# Altium project workerBoard.PrjPcb
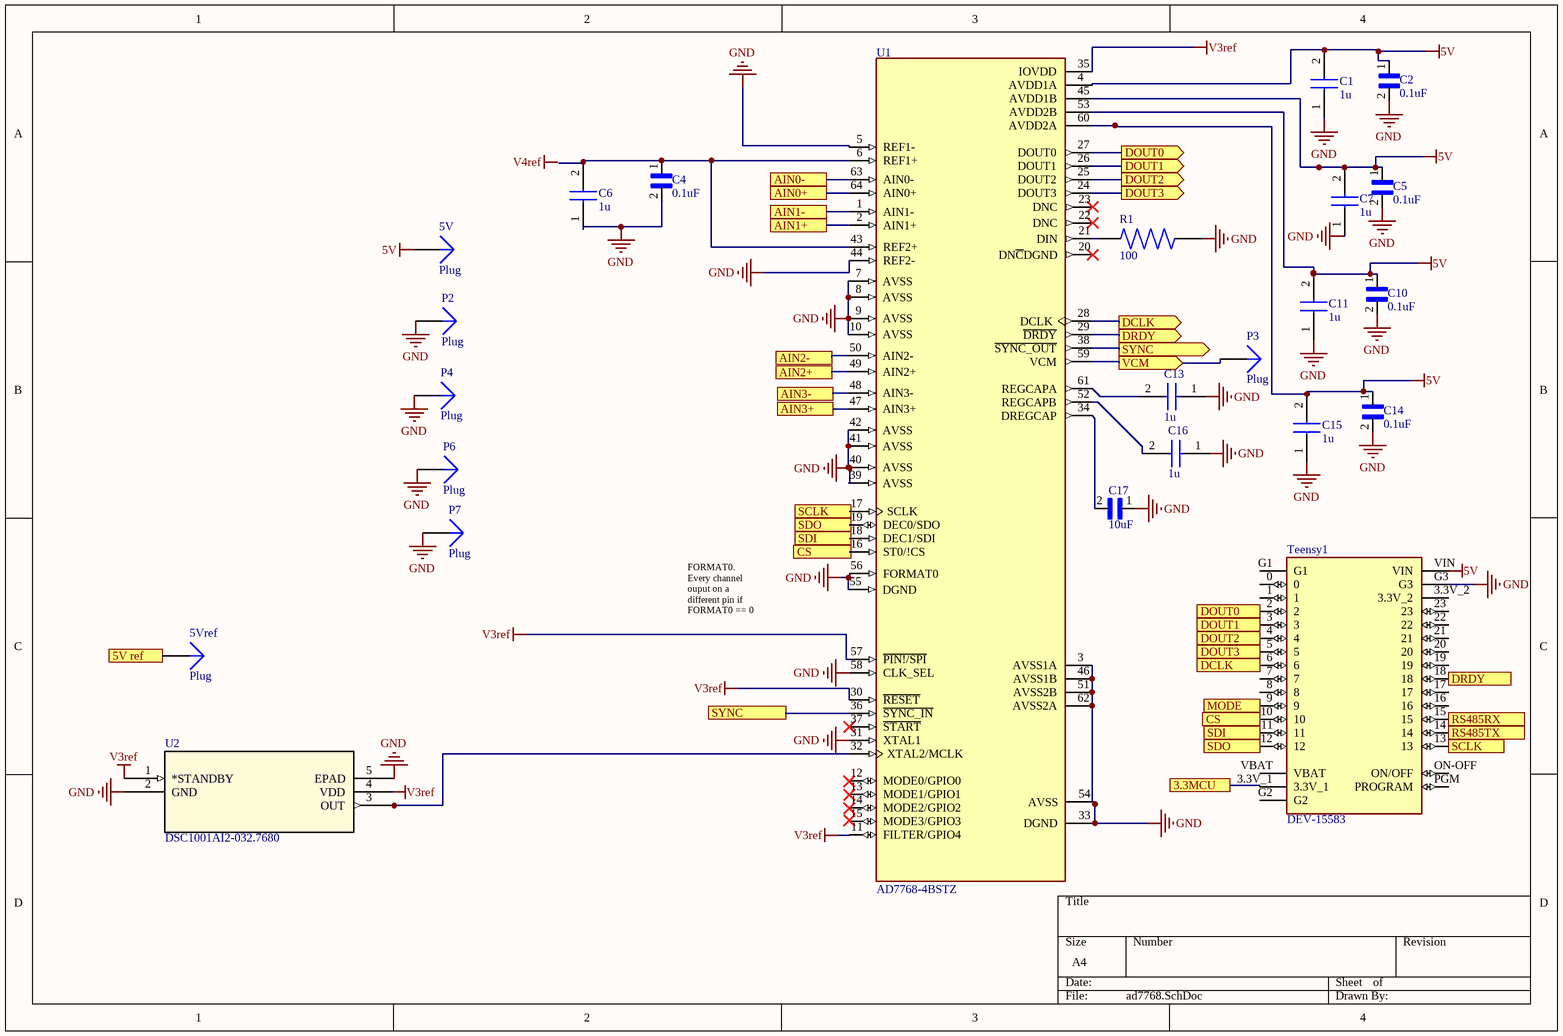
[diagram p0: ad7768.SchDoc]
6 sheets, 91 parts. Net scope: flat (ports and power ports of the same name join across sheets).
Board files: ADC_RS_MCU_draft.PcbDoc, accel.PcbDoc, ADC_RS_MCU.PcbDoc
Sheets:
  ad7768.SchDoc
  Vref.SchDoc
  driver0-3.SchDoc
  thvd8000.SchDoc
  accel.SchDoc
  power_supply.SchDoc

## Sheet ad7768.SchDoc
size A4; SheetNumber: 1; SheetTotal: 6

### Parts
5V  Plug  [PIN1]
5Vref  Plug  [PIN1]
C1  1u  [CAPC1608X90N]
C2  0.1uF  [CAPC1608X90N]
C4  0.1uF  [CAPC1608X90N]
C5  0.1uF  [CAPC1608X90N]
C6  1u  [CAPC1608X90N]
C7  1u  [CAPC1608X90N]
C10  0.1uF  [CAPC1608X90N]
C11  1u  [CAPC1608X90N]
C13  1u  [CAPC1608X90N]
C14  0.1uF  [CAPC1608X90N]
C15  1u  [CAPC1608X90N]
C16  1u  [CAPC1608X90N]
C17  10uF  [CAPC1608X9N]
P2  Plug  [PIN1]
P3  Plug  [PIN1]
P4  Plug  [PIN1]
P6  Plug  [PIN1]
P7  Plug  [PIN1]
R1  100  [RESC1508X55N]
Teensy1  DEV-15583  [MODULE_DEV-15583]
U1  AD7768-4BSTZ
U2  DSC1001AI2-032.7680  [DFN4_7X5_MCH]

### Ports
3.3MCU, 5V ref, AIN0+, AIN0-, AIN1+, AIN1-, AIN2+, AIN2-, AIN3+, AIN3-, CS, DCLK (out), DOUT0 (out), DOUT1 (out), DOUT2 (out), DOUT3 (out), DRDY (out), MODE, RS485RX, RS485TX, SCLK, SDI, SDO, SYNC, SYNC (out), VCM (out)

### Nets
5V: 5V.1 C1.2 C2.1 C5.1 C7.2 C10.1 C11.2 C14.1 C15.2 Teensy1.VIN U1.4(AVDD1A) U1.45(AVDD1B) U1.53(AVDD2B) U1.60(AVDD2A)
GND: C1.1 C2.2 C4.2 C5.2 C6.1 C7.1 C10.2 C11.1 C13.1 C14.2 C15.1 C16.1 C17.1 P2.1 P4.1 P6.1 P7.1 R1.2 Teensy1.G3 U1.3(AVSS1A) U1.5(REF1-) U1.7(AVSS) U1.8(AVSS) U1.9(AVSS) U1.10(AVSS) U1.31(XTAL1) U1.33(DGND) U1.39(AVSS) U1.40(AVSS) U1.41(AVSS) U1.42(AVSS) U1.44(REF2-) U1.46(AVSS1B) U1.51(AVSS2B) U1.54(AVSS) U1.55(DGND) U1.56(FORMAT0) U1.58(CLK_SEL) U1.62(AVSS2A) U2.2(GND) U2.5(EPAD)
V3ref: U1.11(FILTER/GPIO4) U1.30(~{RESET}) U1.35(IOVDD) U1.57(~{PIN!/SPI}) U2.1(*STANDBY) U2.4(VDD)
3.3MCU: Teensy1.3.3V_1 ; port 3.3MCU
5V ref: 5Vref.1 ; port 5V ref
AIN0+: U1.64(AIN0+) ; port AIN0+
AIN0-: U1.63(AIN0-) ; port AIN0-
AIN1+: U1.2(AIN1+) ; port AIN1+
AIN1-: U1.1(AIN1-) ; port AIN1-
AIN2+: U1.49(AIN2+) ; port AIN2+
AIN2-: U1.50(AIN2-) ; port AIN2-
AIN3+: U1.47(AIN3+) ; port AIN3+
AIN3-: U1.48(AIN3-) ; port AIN3-
CS: Teensy1.10 U1.16(ST0/!CS) ; port CS
DCLK: Teensy1.6 U1.28(DCLK) ; port DCLK
DOUT0: Teensy1.2 U1.27(DOUT0) ; port DOUT0
DOUT1: Teensy1.3 U1.26(DOUT1) ; port DOUT1
DOUT2: Teensy1.4 U1.25(DOUT2) ; port DOUT2
DOUT3: Teensy1.5 U1.24(DOUT3) ; port DOUT3
DRDY: Teensy1.18 U1.29(~{DRDY}) ; port DRDY
MODE: Teensy1.9 ; port MODE
RS485RX: Teensy1.15 ; port RS485RX
RS485TX: Teensy1.14 ; port RS485TX
SCLK: Teensy1.13 U1.17(SCLK) ; port SCLK
SDI: Teensy1.11 U1.18(DEC1/SDI) ; port SDI
SDO: Teensy1.12 U1.19(DEC0/SDO) ; port SDO
SYNC: U1.36(~{SYNC_IN}) U1.38(~{SYNC_OUT}) ; port SYNC
VCM: P3.1 U1.59(VCM) ; port VCM
NetC4_1: C4.1 C6.2 U1.6(REF1+) U1.43(REF2+)
NetC13_2: C13.2 U1.61(REGCAPA)
NetC16_2: C16.2 U1.52(REGCAPB)
NetC17_2: C17.2 U1.34(DREGCAP)
NetR1_1: R1.1 U1.21(DIN)
NetU1_32: U1.32(XTAL2/MCLK) U2.3(OUT)

Not connected (* = marked no-connect by the designer): Teensy1 0 1 3.3V_2 7 8 16 17 19 20 21 22 23 G1 G2 ON-OFF(ON/OFF) PGM(PROGRAM) VBAT; U1 12(MODE0/GPIO0)* 13(MODE1/GPIO1)* 14(MODE2/GPIO2)* 15(MODE3/GPIO3) 20(DN~{C}DGND)* 22(DNC)* 23(DNC)* 37(~{START})*

### Notes on the sheet
- FORMAT0. Every channel ouput on a different pin if FORMAT0 == 0
- Labels drawn without touching a wire or pin: V4ref

### Library data of the parts
5V 5Vref P2-P4 P6 P7 = CMP-010-000007-1: Signal Integrity: Connector; LatestRevisionDate: 17-Jul-2002; LatestRevisionNote: Re-released for DXP Platform.; Publisher: Altium Limited; Component Type: Standard; Design Item ID: Plug; Pin Count: 1; Source: workerBoard.SCHLIB
C1 C6 C7 C11 C13 C15 C16 = CMP-003-000003-1: Capacitor; Manufacturer_Name: AVX; Datasheet Link: https://componentsearchengine.com/Datasheets/1/06031A100FAT2A.pdf; Height: 0.9mm; Manufacturer_Part_Number: 0603YC105MAT4A; Component Type: Standard; Design Item ID: 0603YC105MAT4A; Pin Count: 2; Source: workerBoard.SCHLIB
C2 C4 C5 C10 C14 = CMP-003-000001-1: Cap Ceramic 0.1uF 25V X5R 10% SMD 0603 85ÂÂŽ T/R; MF: {'manufacturer': u'AVX'}; Price: None; Availability: Unavailable; Value: *; MP: 06033D104KAT2A; Package: None; Component Type: Standard; Design Item ID: 06033D104KAT2A; Pin Count: 2; Source: workerBoard.SCHLIB
C17 = CMP-003-000008-1: CAP CER 10UF 10V X5R 0603; MP: GRT188R61A106ME13D; MF: {'manufacturer': u'Murata'}; Price: None; Availability: Unavailable; Value: *; Package: None; Component Type: Standard; Design Item ID: GRT188R61A106ME13D; Pin Count: 2; Source: workerBoard.SCHLIB
R1 = CMP-008-000002-1: MP: MCT0603MD1000DP500; MF: {'manufacturer': u'Vishay'}; Price: None; Availability: Unavailable; Value: *; Package: None; Component Type: Standard; Design Item ID: MCT0603MD1000DP500; Pin Count: 2; Source: workerBoard.SCHLIB
Teensy1 = CMP-010-000005-1: RT1062 Teensy 4.0 i.MX ARMÂ® CortexÂ®-M7 MPU Embedded Evaluation Board; MF: SparkFun Electronics; Value: *; Package: None; Digi-Key_Part_Number: 1568-DEV-15583-ND; Digi-Key_Purchase_URL: https://www.digikey.com/product-detail/en/sparkfun-electronics/DEV-15583/1568-DEV-15583-ND/10384551?utm_source=snapeda&utm_medium=aggregator&utm_campaign=symbol; MP: DEV-15583; SnapEDA_Link: https://www.snapeda.com/parts/DEV-15583/SparkFun%20Electronics/view-part/4001229/?ref=snap; Component Type: Standard; Design Item ID: DEV-15583; Pin Count: 33; Source: workerBoard.SCHLIB
U1 = CMP-005-000000-1: 24 Bit Analog to Digital Converter 4 Input 4 Sigma-Delta 64-LQFP _10x10_; MF: Analog Devices; Digi-Key_Purchase_URL: https://www.digikey.com/product-detail/en/analog-devices-inc/AD7768-4BSTZ/AD7768-4BSTZ-ND/6072260?utm_source=snapeda&utm_medium=aggregator&utm_campaign=symbol; Package: LQFP -64 Analog Devices; SnapEDA_Link: https://www.snapeda.com/parts/AD7768-4BSTZ/Analog%20Devices%20Inc./view-part/501603/?ref=snap; Value: *; MP: AD7768-4BSTZ; Digi-Key_Part_Number: AD7768-4BSTZ-ND; Component Type: Standard; Design Item ID: AD7768-4BSTZ; Pin Count: 64; Source: workerBoard.SCHLIB
U2 = CMP-010-000006-1: No Description Available; Mfr_Name: Microchip; Copyright: Copyright (C) 2021 Ultra Librarian. All rights reserved.; Manufacturer_Part_Number: DSC1001AI2-032.7680; Digi-Key_Part_Number_1: DSC1001AI2-032.7680-ND; RefDes: RefDes; Type: DEV; Component Type: Standard; Design Item ID: DSC1001AI2-032.7680; Pin Count: 5; Source: workerBoard.SCHLIB

## Sheet Vref.SchDoc
size A4; SheetNumber: 2; SheetTotal: 6
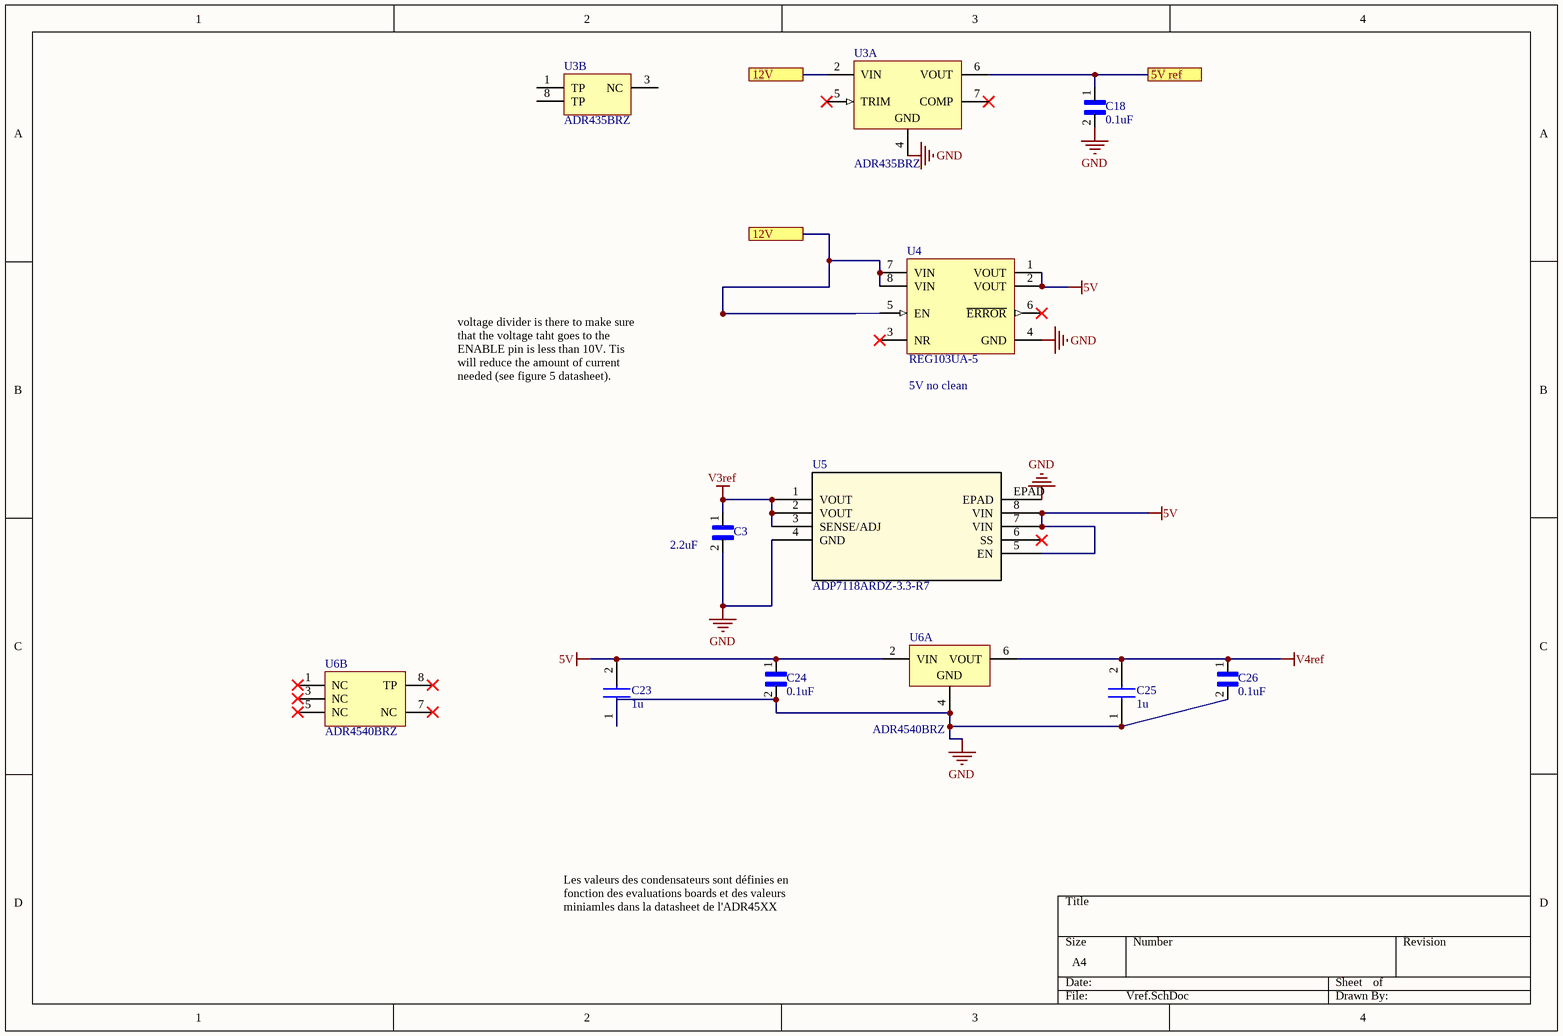
[diagram p1: Vref.SchDoc]

### Parts
C3  2.2uF  [CAPC1608X90]
C18  0.1uF  [CAPC1608X90N]
C23  1u  [CAPC1608X90N]
C24  0.1uF  [CAPC1608X90N]
C25  1u  [CAPC1608X90N]
C26  0.1uF  [CAPC1608X90N]
U3  ADR435BRZ  [ADI-R-8_M]  (parts A,B of 2)
U4  REG103UA-5  [D0008A_M]
U5  ADP7118ARDZ-3.3-R7  [SOIC_08_EP_3P9X4P9_ADI]
U6  ADR4540BRZ  [ADI-R-8_M]  (parts A,B of 2)

### Ports
5V ref, 12V

### Nets
5V: C23.2 C24.1 U4.1(VOUT) U4.2(VOUT) U5.5(EN) U5.7(VIN) U5.8(VIN) U6.2(VIN)
GND: C3.2 C18.2 C23.1 C24.2 C25.1 C26.2 U3.4(GND) U4.4(GND) U5.4(GND) U5.EPAD U6.4(GND)
V3ref: C3.1 U5.1(VOUT) U5.2(VOUT) U5.3(SENSE/ADJ)
V4ref: C25.2 C26.1 U6.6(VOUT)
5V ref: C18.1 U3.6(VOUT) ; port 5V ref
12V: U3.2(VIN) U4.5(EN) U4.7(VIN) U4.8(VIN) ; port 12V

Not connected (* = marked no-connect by the designer): U3 1(TP) 3(NC) 5(TRIM)* 7(COMP)* 8(TP); U4 3(NR)* 6(~{ERROR})*; U5 6(SS)*; U6 1(NC)* 3(NC)* 5(NC)* 7(NC)* 8(TP)*

### Notes on the sheet
- voltage divider is there to make sure that the voltage taht goes to the ENABLE pin is less than 10V. Tis will reduce the amount of current needed (see figure 5 datasheet).
- (near U4) 5V no clean
- Les valeurs des condensateurs sont définies en fonction des evaluations boards et des valeurs miniamles dans la datasheet de l'ADR45XX

### Library data of the parts
C3 = CMP-003-000006-1: 2.2UF 16V 20%; MP: F981C225MMA; MF: {'manufacturer': u'AVX'}; Package: None; Availability: Unavailable; Value: *; Price: None; Component Type: Standard; Design Item ID: F981C225MMA; Pin Count: 2; Source: workerBoard.SCHLIB
C18 C24 C26 = CMP-003-000001-1: as C2 on sheet ad7768; Price: None; Availability: Unavailable; Value: *; MP: 06033D104KAT2A; Package: None; Component Type: Standard; Design Item ID: 06033D104KAT2A; Pin Count: 2; Source: workerBoard.SCHLIB
C23 C25 = CMP-003-000003-1: Capacitor; Manufacturer_Name: AVX; Datasheet Link: https://componentsearchengine.com/Datasheets/1/06031A100FAT2A.pdf; Height: 0.9mm; Manufacturer_Part_Number: 0603YC105MAT4A; Component Type: Standard; Design Item ID: 0603YC105MAT4A; Pin Count: 2; Source: workerBoard.SCHLIB
U3 = CMP-006-000001-1: Ultralow Noise XFET Voltage Reference with Current Sink and Source Capability, 5 V Output, 7 to 18 V Supply, Industrial, 8-pin SOIC (R-8), Tube; Manufacturer: Analog Devices; Max V Supply (V): 18; Vout: 5V; Ref Out TC (ppm/C): 1; Min V Supply (V): 7; ComponentLink4Description: URL Link1; ComponentLink3Description: Package Specification; Mounting Technology: Surface Mount; DatasheetVersion: Rev. J; PackageDescription: 8-Pin Standard Small Outline Package, Body 4.9 x 3.9 mm, Pitch 1.27 mm; Packing: Tube; PackageVersion: 060506-A, 06/2006; PackageReference: R-8; ComponentLink2Description: Datasheet; PartNumber: ADR435BRZ; ComponentLink3URL: http://www.analog.com/static/imported-files/packages/PKG_PDF/SOIC_Narrow%20(R)/R_8.pdf; ComponentLink1Description: Manufacturer URL; ComponentLink2URL: http://www.analog.com/static/imported-files/data_sheets/ADR430_431_433_434_435_439.pdf; Operating Temp Range: -40 to 125 degC; Code_JEDEC: MS-012-AA; ComponentLink4URL: Product URL:http://www.analog.com/en/special-linear-functions/voltage-references/adr435/products/product.html; ComponentLink1URL: http://www.analog.com/en/index.html; Component Type: Standard; Design Item ID: CMP-0784-00226-1; Manufacturer Part Number: ADR435BRZ; Pin Count: 8; Source: workerBoard.SCHLIB
U4 = CMP-010-000004-1: Single Output Fast Transient Response LDO, 500 mA, Fixed 5 V Output, 2.1 to 15 V Input, 8-pin SOIC (D), -55 to 125 degC, Green (RoHS & no Sb/Br); Manufacturer: Texas Instruments; Vdo(Typ)(mV): 160; Accuracy(%): 2; Iq(Typ)(mA): 0.5; Vin(Max)(V): 15; Power Good: TRUE; SubFamily: Single Channel LDO; Vout Adj(Max)(V): 5; Vin(Min)(V): 2.1; Mounting Technology: Surface Mount; ComponentLink1URL: http://www.ti.com/; PackageReference: D0008A; ComponentLink1Description: Manufacturer URL; Eco-Plan: Green (RoHS & no Sb/Br); PackageVersion: 4040047-3/M; PartNumber: REG103UA-5; Code_JEDEC: MS-012; DatasheetVersion: SBVS010D; ComponentLink2Description: Datasheet; PackageDescription: 8-Pin Plastic Small Outline, Body 4.9 x 3.9 mm, Pitch 1.27 mm; ComponentLink2URL: http://www.ti.com/general/docs/lit/getliterature.tsp?genericPartNumber=REG103-5&fileType=pdf; ComponentLink3URL: http://www.ti.com/litv/pdf/msoi002j; Fixed Output Options(V): 5; Iout(Max)(A): 0.5; Vout Adj(Min)(V): 5; ComponentLink3Description: Package Specification; Component Type: Standard; Design Item ID: CMP-0395-00135-2; Manufacturer Part Number: REG103UA-5; Pin Count: 8; Source: workerBoard.SCHLIB
U5 = CMP-010-000001-1: No Description Available; Mfr_Name: Analog Devices Inc; Copyright: Copyright (C) 2021 Ultra Librarian. All rights reserved.; Manufacturer_Part_Number: ADP7118ARDZ-3.3-R7; RefDes: RefDes; Type: DEV; Component Type: Standard; Design Item ID: ADP7118ARDZ-3.3-R7; Pin Count: 9; Source: workerBoard.SCHLIB
U6 = CMP-006-000000-1: Ultralow Noise, High Accuracy Voltage Reference, 4.096 V Output, 3 to 15 V Supply, Industrial, 8-pin SOIC (R-8), Tube; Manufacturer: Analog Devices; Max V Supply (V): 15; Min V Supply (V): 3; Vout: 4.096V; Ref Out TC (ppm/C): 2; ComponentLink4URL: Product URL:http://www.analog.com/en/special-linear-functions/voltage-references/adr4540/products/product.html; Mounting Technology: Surface Mount; ComponentLink1Description: Manufacturer URL; PackageDescription: 8-Pin Standard Small Outline Package, Body 4.9 x 3.9 mm, Pitch 1.27 mm; ComponentLink2URL: http://www.analog.com/static/imported-files/data_sheets/ADR4520_4525_4530_4533_4540_4550.pdf; ComponentLink1URL: http://www.analog.com/en/index.html; DatasheetVersion: Rev. 0; ComponentLink4Description: URL Link1; Operating Temp Range: -40 to 125 degC; PartNumber: ADR4540BRZ; ComponentLink2Description: Datasheet; ComponentLink3URL: http://www.analog.com/static/imported-files/packages/PKG_PDF/SOIC_Narrow%20(R)/R_8.pdf; ComponentLink3Description: Package Specification; PackageVersion: 060506-A, 06/2006; Packing: Tube; PackageReference: R-8; Code_JEDEC: MS-012-AA; Component Type: Standard; Design Item ID: CMP-0784-00192-1; Manufacturer Part Number: ADR4540BRZ; Pin Count: 8; Source: workerBoard.SCHLIB

## Sheet driver0-3.SchDoc
size A4; SheetNumber: 3; SheetTotal: 6
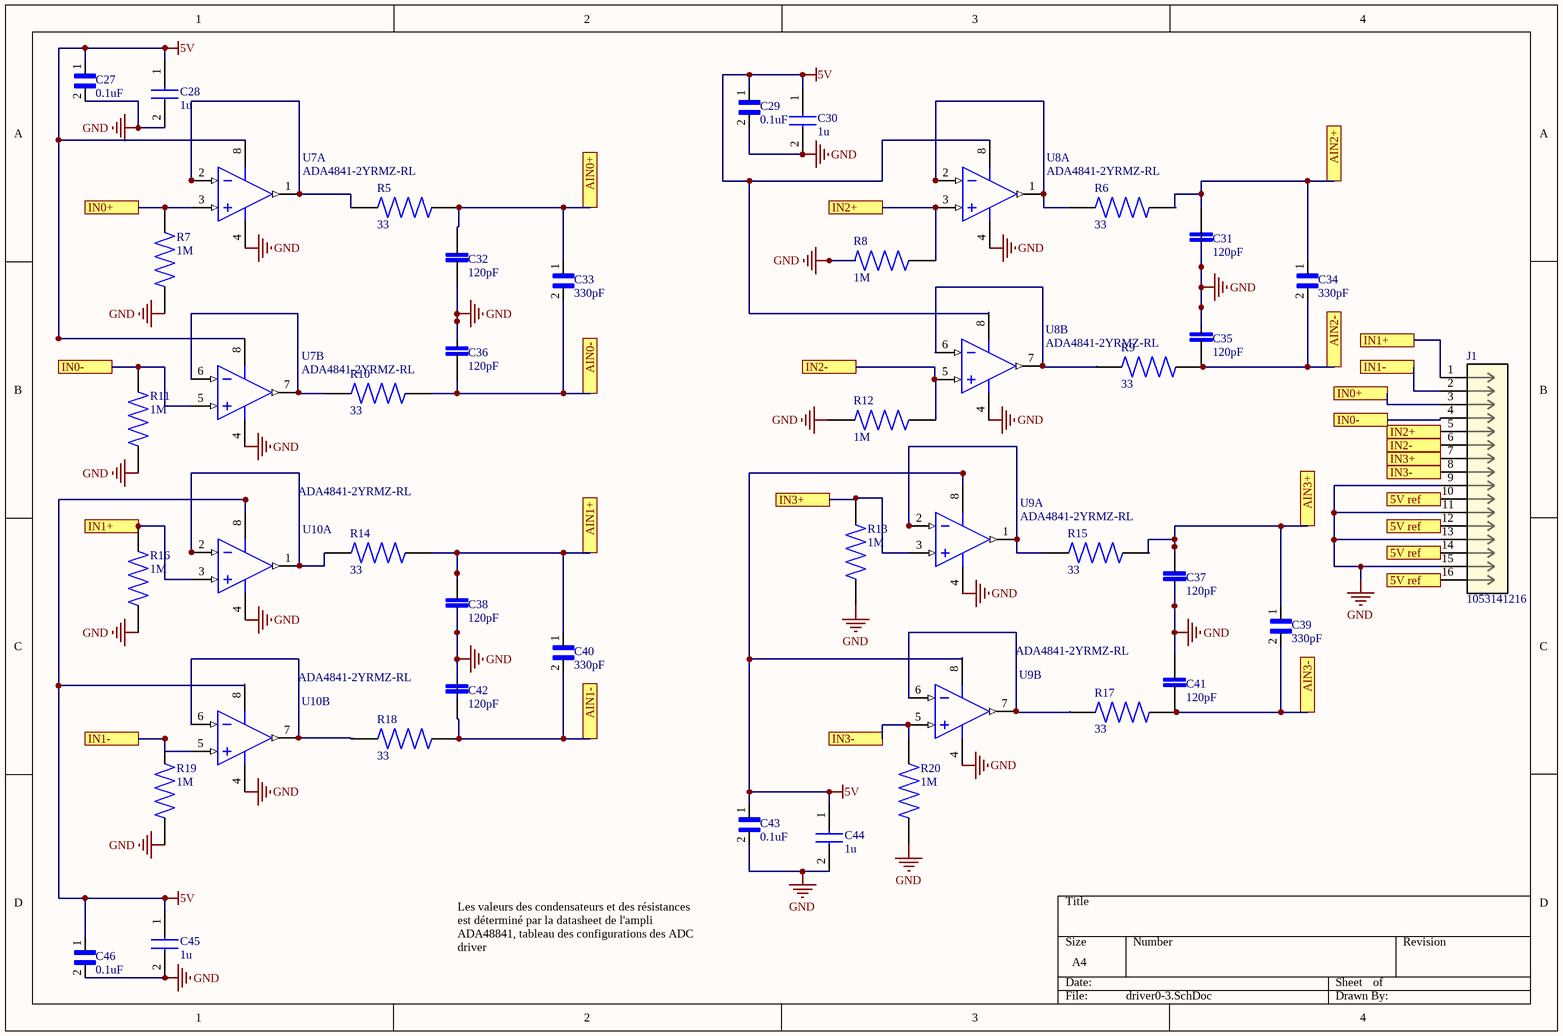
[diagram p2: driver0-3.SchDoc]

### Parts
C27  0.1uF  [CAPC1608X90N]
C28  1u  [CAPC1608X90N]
C29  0.1uF  [CAPC1608X90N]
C30  1u  [CAPC1608X90N]
C31  120pF  [CAPC1608X90]
C32  120pF  [CAPC1608X90]
C33  330pF  [CAPC1608X90]
C34  330pF  [CAPC1608X90]
C35  120pF  [CAPC1608X90]
C36  120pF  [CAPC1608X90]
C37  120pF  [CAPC1608X90]
C38  120pF  [CAPC1608X90]
C39  330pF  [CAPC1608X90]
C40  330pF  [CAPC1608X90]
C41  120pF  [CAPC1608X90]
C42  120pF  [CAPC1608X90]
C43  0.1uF  [CAPC1608X90N]
C44  1u  [CAPC1608X90N]
C45  1u  [CAPC1608X90N]
C46  0.1uF  [CAPC1608X90N]
J1  1053141216  [CON_1053141216]
R5  33  [RESC1608X55N]
R6  33  [RESC1608X55N]
R7  1M  [RESC1608X55N]
R8  1M  [RESC1608X55N]
R9  33  [RESC1608X55N]
R10  33  [RESC1608X55N]
R11  1M  [RESC1608X55N]
R12  1M  [RESC1608X55N]
R13  1M  [RESC1608X55N]
R14  33  [RESC1608X55N]
R15  33  [RESC1608X55N]
R16  1M  [RESC1608X55N]
R17  33  [RESC1608X55N]
R18  33  [RESC1608X55N]
R19  1M  [RESC1608X55N]
R20  1M  [RESC1608X55N]
U7  ADA4841-2YRMZ-RL  [ADI-RM-8_M]  (parts A,B of 2)
U8  ADA4841-2YRMZ-RL  [ADI-RM-8_M]  (parts A,B of 2)
U9  ADA4841-2YRMZ-RL  [ADI-RM-8_M]  (parts A,B of 2)
U10  ADA4841-2YRMZ-RL  [ADI-RM-8_M]  (parts A,B of 2)

### Ports
5V ref, AIN0+, AIN0-, AIN1+, AIN1-, AIN2+, AIN2-, AIN3+, AIN3-, IN0+, IN0-, IN1+, IN1-, IN2+, IN2-, IN3+, IN3-

### Nets
5V: C27.1 C28.1 C29.1 C30.1 C43.1 C44.1 C45.1 C46.1 U7.8(+VS) U8.8(+VS) U9.8(+VS) U10.8(+VS)
GND: C27.2 C28.2 C29.2 C30.2 C31.1 C32.1 C35.2 C36.2 C37.1 C38.1 C41.2 C42.2 C43.2 C44.2 C45.2 C46.2 J1.9 J1.11 J1.13 J1.15 R7.1 R8.2 R11.1 R12.2 R13.1 R16.1 R19.1 R20.1 U7.4(-VS) U8.4(-VS) U9.4(-VS) U10.4(-VS)
5V ref: J1.10 J1.12 J1.14 J1.16 ; port 5V ref
AIN0+: C32.2 C33.1 R5.2 ; port AIN0+
AIN0-: C33.2 C36.1 R10.2 ; port AIN0-
AIN1+: C38.2 C40.1 R14.2 ; port AIN1+
AIN1-: C40.2 C42.1 R18.2 ; port AIN1-
AIN2+: C31.2 C34.1 R6.2 ; port AIN2+
AIN2-: C34.2 C35.1 R9.2 ; port AIN2-
AIN3+: C37.2 C39.1 R15.2 ; port AIN3+
AIN3-: C39.2 C41.1 R17.2 ; port AIN3-
IN0+: J1.3 R7.2 U7.3(+IN_1) ; port IN0+
IN0-: J1.4 R11.2 U7.5(+IN_2) ; port IN0-
IN1+: J1.1 R16.2 U10.3(+IN_1) ; port IN1+
IN1-: J1.2 R19.2 U10.5(+IN_2) ; port IN1-
IN2+: J1.5 R8.1 U8.3(+IN_1) ; port IN2+
IN2-: J1.6 R12.1 U8.5(+IN_2) ; port IN2-
IN3+: J1.7 R13.2 U9.3(+IN_1) ; port IN3+
IN3-: J1.8 R20.2 U9.5(+IN_2) ; port IN3-
NetR5_1: R5.1 U7.1(OUT_1) U7.2(-IN_1)
NetR6_1: R6.1 U8.1(OUT_1) U8.2(-IN_1)
NetR9_1: R9.1 U8.6(-IN_2) U8.7(OUT_2)
NetR10_1: R10.1 U7.6(-IN_2) U7.7(OUT_2)
NetR14_1: R14.1 U10.1(OUT_1) U10.2(-IN_1)
NetR15_1: R15.1 U9.1(OUT_1) U9.2(-IN_1)
NetR17_1: R17.1 U9.6(-IN_2) U9.7(OUT_2)
NetR18_1: R18.1 U10.6(-IN_2) U10.7(OUT_2)

### Notes on the sheet
- Les valeurs des condensateurs et des résistances est déterminé par la datasheet de l'ampli ADA48841, tableau des configurations des ADC driver

### Library data of the parts
C27 C29 C43 C46 = CMP-003-000001-1: as C2 on sheet ad7768; Price: None; Availability: Unavailable; Value: *; MP: 06033D104KAT2A; Package: None; Component Type: Standard; Design Item ID: 06033D104KAT2A; Pin Count: 2; Source: workerBoard.SCHLIB
C28 C30 C44 C45 = CMP-003-000003-1: Capacitor; Manufacturer_Name: AVX; Datasheet Link: https://componentsearchengine.com/Datasheets/1/06031A100FAT2A.pdf; Height: 0.9mm; Manufacturer_Part_Number: 0603YC105MAT4A; Component Type: Standard; Design Item ID: 0603YC105MAT4A; Pin Count: 2; Source: workerBoard.SCHLIB
C31 C32 C35-C38 C41 C42 = CMP-003-000002-1: 0603 120 pF 50 V Â±2 % Tolerance C0G/NP0 SMT Multilayer Ceramic Capacitor; MF: {'manufacturer': u'AVX'}; Price: None; Availability: Unavailable; Value: *; MP: 06035A121GAT2A; Package: None; Component Type: Standard; Design Item ID: 06035A121GAT2A; Pin Count: 2; Source: workerBoard.SCHLIB
C33 C34 C39 C40 = CMP-003-000000-1: 0603 SMD Ceramic Capacitors 0603 330pF 25volts C0G 2%; MP: 06033A331GAT2A; MF: {'manufacturer': u'AVX'}; Price: None; Availability: Unavailable; Value: *; Package: None; Component Type: Standard; Design Item ID: 06033A331GAT2A; Pin Count: 2; Source: workerBoard.SCHLIB
J1 = CMP-010-000000-1: No Description Available; Mfr_Name: Molex Connector Corporation; Copyright: Copyright (C) 2021 Ultra Librarian. All rights reserved.; Manufacturer_Part_Number: 1053141216; Digi-Key_Part_Number_1: WM15165-ND; RefDes: RefDes; Type: DEV; Component Type: Standard; Design Item ID: 1053141216; Pin Count: 16; Source: workerBoard.SCHLIB
R5 R6 R9 R10 R14 R15 R17 R18 = CMP-008-000006-1: RES SMD 33 OHM 0.1% 1/10W 0603; MP: RT0603BRD0733RL; MF: {'manufacturer': u'Yageo'}; Price: None; Availability: Unavailable; Value: *; Package: None; Component Type: Standard; Design Item ID: RT0603BRD0733RL_2; Pin Count: 2; Source: workerBoard.SCHLIB
R7 R8 R11-R13 R16 R19 R20 = CMP-008-000007-1: MP: RT0603DRD071ML; MF: {'manufacturer': u'Yageo'}; Price: None; Availability: Unavailable; Value: *; Package: None; Component Type: Standard; Design Item ID: RT0603DRD071ML; Pin Count: 2; Source: workerBoard.SCHLIB
U7-U10 = CMP-007-000000-1: Double Channel Low Wide Band Noise Operational Amplifier, 80 MHz BW, 13 V/us SR, Industrial, 8-pin SOP (RM-8), Reel; Manufacturer: Analog Devices; Slew Rate: 13V/us; Iq/Amp: 1.5mA; Amplifiers Per Package: 2; Small Signal Bandwidth: 80MHz; V Span Min: 2.7V; V Span Max: 12V; Input Offset Voltage: 40uV; Input Bias Current: 3uA; ComponentLink3URL: http://www.analog.com/static/imported-files/packages/PKG_PDF/MSOP%28RM%29/RM_8.pdf; PartNumber: ADA4841-2YRMZ-RL; Mounting Technology: Surface Mount; DatasheetVersion: Rev. E; PackageDescription: 8-Pin Mini Small Outline Package, Body 3 x 3 mm, Pitch 0.65 mm; PackageReference: RM-8; ComponentLink2URL: http://www.analog.com/static/imported-files/data_sheets/ADA4841-1_4841-2.pdf; ComponentLink1Description: Manufacturer URL; ComponentLink2Description: Datasheet; Generic Part Number: ADA4841-2; ComponentLink1URL: http://www.analog.com/en/index.html; Code_JEDEC: MO-187-AA; ComponentLink3Description: Package Specification; Component Type: Standard; Design Item ID: CMP-0384-01677-1; Manufacturer Part Number: ADA4841-2YRMZ-RL; Pin Count: 8; Source: workerBoard.SCHLIB

## Sheet thvd8000.SchDoc
size A4; SheetNumber: 4; SheetTotal: 6
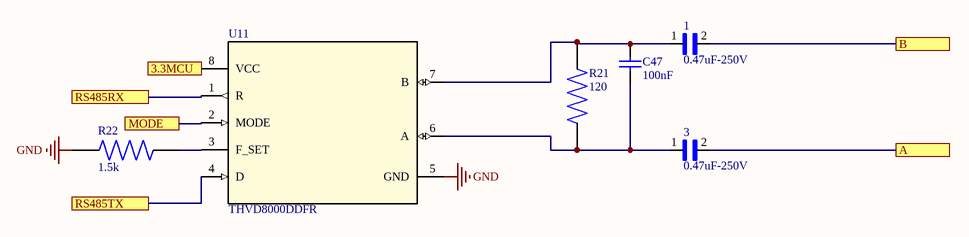
[diagram p3: thvd8000.SchDoc]

### Parts
1  0.47uF-250V  [CAPC3326X280N]
3  0.47uF-250V  [CAPC3326X280N]
C47  100nF  [CAPC3216X94X50ML20T25]
R21  120  [RES_ERA3AEB121V]
R22  1.5k  [RESC1608X55N]
U11  THVD8000DDFR  [DDF0008A-IPC_A]

### Ports
3.3MCU, A, B, MODE, RS485RX, RS485TX

### Nets
GND: R22.1 U11.5(GND)
3.3MCU: U11.8(VCC) ; port 3.3MCU
A: 3.2 ; port A
B: 1.2 ; port B
MODE: U11.2(MODE) ; port MODE
RS485RX: U11.1(R) ; port RS485RX
RS485TX: U11.4(D) ; port RS485TX
Net1_1: 1.1 C47.1 R21.2 U11.7(B)
Net3_1: 3.1 C47.2 R21.1 U11.6(A)
NetR22_2: R22.2 U11.3(F_SET)

### Library data of the parts
1 3 = CMP-010-000002-1: MF: {'manufacturer': u'KEMET'}; MP: C1210X474KARACAUTO; Value: *; Package: None; Price: None; Availability: Unavailable; Component Type: Standard; Design Item ID: C1210X474KARACAUTO; Pin Count: 2; Source: workerBoard.SCHLIB
C47 = CMP-003-000005-1: Chip Capacitor, Ceramic, 100 nF, 10%, 50 V, 1206, RoHS, Tape and Reel; Manufacturer: Kyocera AVX; Manufacturer Part Number: 12065C104KAT2A; Rated Voltage: 50V; Dielectric: X7R; Datasheet URL: http://www.mouser.com/ds/2/40/cauto-360.pdf; Capacitance: 100nF; Manufacturer URL: http://www.avx.com/; Datasheet Version: Sep-14; Tolerance (%): ±10%; Case Size/Dimension: 1206; Component Type: Standard; Design Item ID: CMP-2000-05018-1; Pin Count: 2; Source: workerBoard.SCHLIB
R21 = CMP-008-000000-1: MP: ERA3AEB121V; MF: {'manufacturer': u'Panasonic'}; Price: None; Availability: Unavailable; Value: *; Package: None; Component Type: Standard; Design Item ID: ERA3AEB121V; Pin Count: 2; Source: workerBoard.SCHLIB
R22 = CMP-008-000003-1: MP: RT0603BRD071K5L; MF: {'manufacturer': u'Yageo'}; Price: None; Availability: Unavailable; Value: *; Package: None; Component Type: Standard; Design Item ID: RT0603BRD071K5L; Pin Count: 2; Source: workerBoard.SCHLIB
U11 = CMP-010-000008-1: No Description Available; Mfr_Name: Texas Instruments; Type: DEV; RefDes: RefDes; Copyright: Copyright (C) 2021 Ultra Librarian. All rights reserved.; Manufacturer_Part_Number: THVD8000DDFR; Component Type: Standard; Design Item ID: THVD8000DDFR; Pin Count: 8; Source: workerBoard.SCHLIB

## Sheet accel.SchDoc
size A4; SheetNumber: 5; SheetTotal: 6
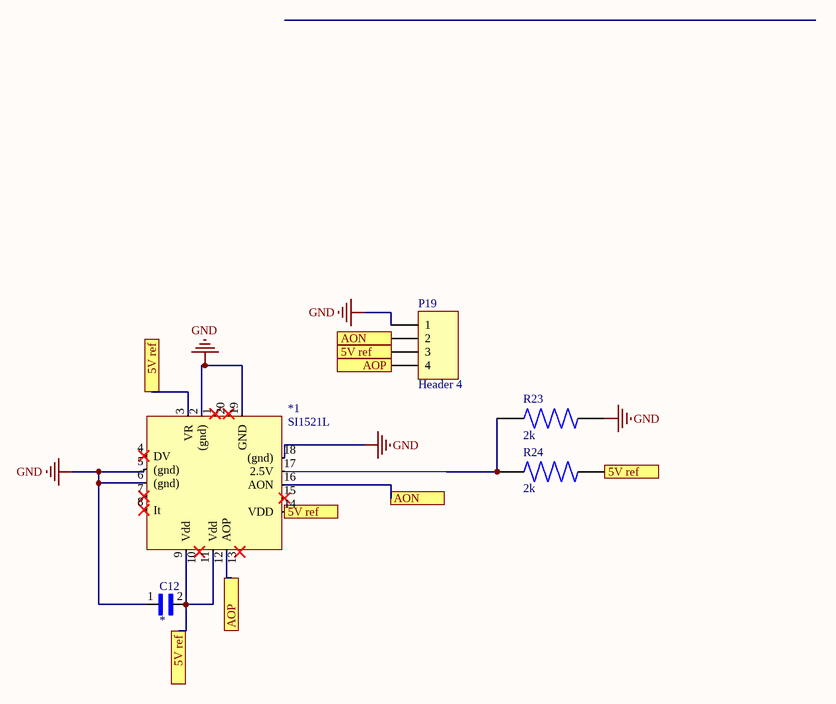
[diagram p4: accel.SchDoc]

### Parts
*1  SI1521L  [LCC127P889X889X254-20N]
C12  0.1uF  [CAPC1608X90N]  (value not drawn)
P19  Header 4  [HDR1X4]
R23  2k  [RESC1608X55N]
R24  2k  [RESC1608X55N]

### Ports
5V ref, AON, AOP

### Nets
GND: *1.2((gnd)) *1.5((gnd)) *1.6((gnd)) *1.18((gnd)) *1.19(GND) C12.1 P19.1 R23.2
5V ref: *1.3(VR) *1.9(Vdd) *1.11(Vdd) *1.14(VDD) C12.2 P19.3 R24.2 ; port 5V ref
AON: *1.16(AON) P19.2 ; port AON
AOP: *1.12(AOP) P19.4 ; port AOP
Net*1_17: *1.17(2.5V) R23.1 R24.1

Not connected (* = marked no-connect by the designer): *1 1* 4(DV)* 7* 8(It)* 10* 13* 15* 20*

### Library data of the parts
*1 = CMP-010-00024-2: Silicon Design SI-1521L-002 +- 2g LCC-20 Surface mount accelerometer
C12 = CMP-003-000001-1: as C2 on sheet ad7768; Design Item ID: 06033D104KAT2A; Value: *; Package: None; Source: workerBoard.SCHLIB; Price: None; MP: 06033D104KAT2A; Pin Count: 2; Component Type: Standard; Availability: Unavailable
P19 = CMP-004-000000-1: Header, 4-Pin; Signal Integrity: Connector; LatestRevisionDate: 17-Jul-2002; LatestRevisionNote: Re-released for DXP Platform.; Publisher: Altium Limited; Component Type: Standard; Design Item ID: Header 4; Pin Count: 4; Source: workerBoard.SCHLIB
R23 R24 = CMP-008-000005-1: RES SMD 33 OHM 0.1% 1/10W 0603; MP: RT0603BRD0733RL; MF: {'manufacturer': u'Yageo'}; Price: None; Availability: Unavailable; Value: *; Package: None; Component Type: Standard; Design Item ID: RT0603BRD0733RL_1; Pin Count: 2; Source: workerBoard.SCHLIB

## Sheet power_supply.SchDoc
size A4; SheetNumber: 6; SheetTotal: 6
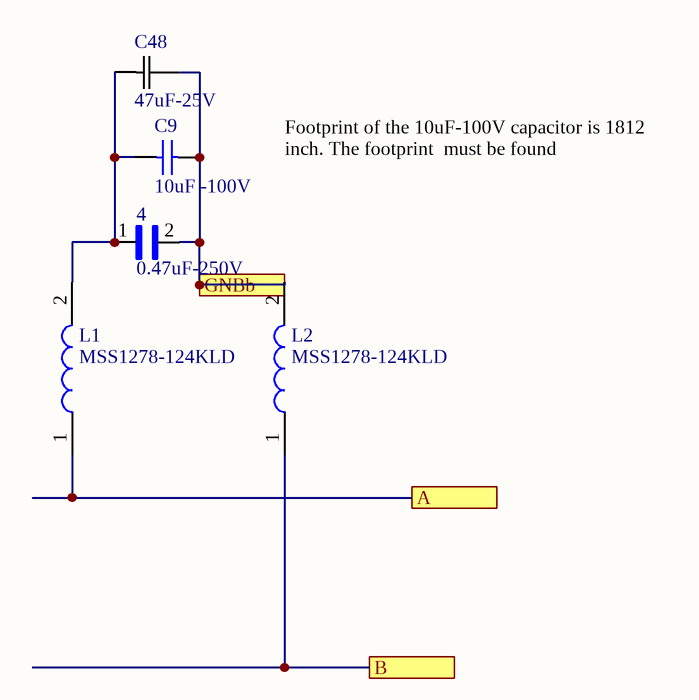
[diagram p5: power_supply.SchDoc]

### Parts
4  0.47uF-250V  [CAPC3326X280N]
C9  value 10uF -100V  (hidden comment: Symbol)
C48  47uF-25V
L1  MSS1278-124KLD  [INDPM120120X805N]
L2  MSS1278-124KLD  [INDPM120120X805N]

### Ports
A, B, GNBb

### Nets
A: L1.1 ; port A
B: L2.1 ; port B
GNBb: 4.2 C9.2 C48.2 L2.2 ; port GNBb
Net4_1: 4.1 C9.1 C48.1 L1.2

### Notes on the sheet
- Footprint of the 10uF-100V capacitor is 1812 inch. The footprint  must be found

### Library data of the parts
4 = CMP-010-000002-1: MF: {'manufacturer': u'KEMET'}; MP: C1210X474KARACAUTO; Value: *; Package: None; Price: None; Availability: Unavailable; Component Type: Standard; Design Item ID: C1210X474KARACAUTO; Pin Count: 2; Source: workerBoard.SCHLIB
C9 = CMP-003-000004-1: Capacitor; SimulationGenericComponent: True; Component Type: Standard; Design Item ID: Capacitor; Pin Count: 2; Source: workerBoard.SCHLIB
C48 = CMP-003-000007-1: No Description Available; Mfr_Name: Murata; Type: DEV; Copyright: Copyright (C) 2021 Ultra Librarian. All rights reserved.; Manufacturer_Part_Number: GRM31CR61E476ME44K; RefDes: RefDes; Component Type: Standard; Design Item ID: GRM31CR61E476ME44K; Pin Count: 2; Source: workerBoard.SCHLIB
L1 L2 = CMP-006-000002-1: Inductor; Manufacturer_Name: COILCRAFT; Datasheet Link: https://componentsearchengine.com/Datasheets/1/MSS1278-124KLD.pdf; Height: 8.05mm; Manufacturer_Part_Number: MSS1278-124KLD; Component Type: Standard; Design Item ID: MSS1278-124KLD; Pin Count: 2; Source: workerBoard.SCHLIB

## Nets that join several sheets
5V: ad7768 (14 pins), Vref (8 pins), driver0-3 (12 pins)
GND: ad7768 (41 pins), Vref (11 pins), driver0-3 (32 pins), thvd8000 (R22.1 U11.5), accel (8 pins)
V3ref: ad7768 (6 pins), Vref (C3.1 U5.1 U5.2 U5.3)
3.3MCU: ad7768 (Teensy1.3.3V_1), thvd8000 (U11.8)
5V ref: ad7768 (5Vref.1), Vref (C18.1 U3.6), driver0-3 (J1.10 J1.12 J1.14 J1.16), accel (7 pins)
A: thvd8000 (3.2), power_supply (L1.1)
AIN0+: ad7768 (U1.64), driver0-3 (C32.2 C33.1 R5.2)
AIN0-: ad7768 (U1.63), driver0-3 (C33.2 C36.1 R10.2)
AIN1+: ad7768 (U1.2), driver0-3 (C38.2 C40.1 R14.2)
AIN1-: ad7768 (U1.1), driver0-3 (C40.2 C42.1 R18.2)
AIN2+: ad7768 (U1.49), driver0-3 (C31.2 C34.1 R6.2)
AIN2-: ad7768 (U1.50), driver0-3 (C34.2 C35.1 R9.2)
AIN3+: ad7768 (U1.47), driver0-3 (C37.2 C39.1 R15.2)
AIN3-: ad7768 (U1.48), driver0-3 (C39.2 C41.1 R17.2)
B: thvd8000 (1.2), power_supply (L2.1)
MODE: ad7768 (Teensy1.9), thvd8000 (U11.2)
RS485RX: ad7768 (Teensy1.15), thvd8000 (U11.1)
RS485TX: ad7768 (Teensy1.14), thvd8000 (U11.4)